# Altium schematic sheet ARM2toARM3_FPA.SchDoc: ARM2 to ARM3 Adapter
size A3; DocumentNumber: 1; SheetNumber: 1; SheetTotal: 1
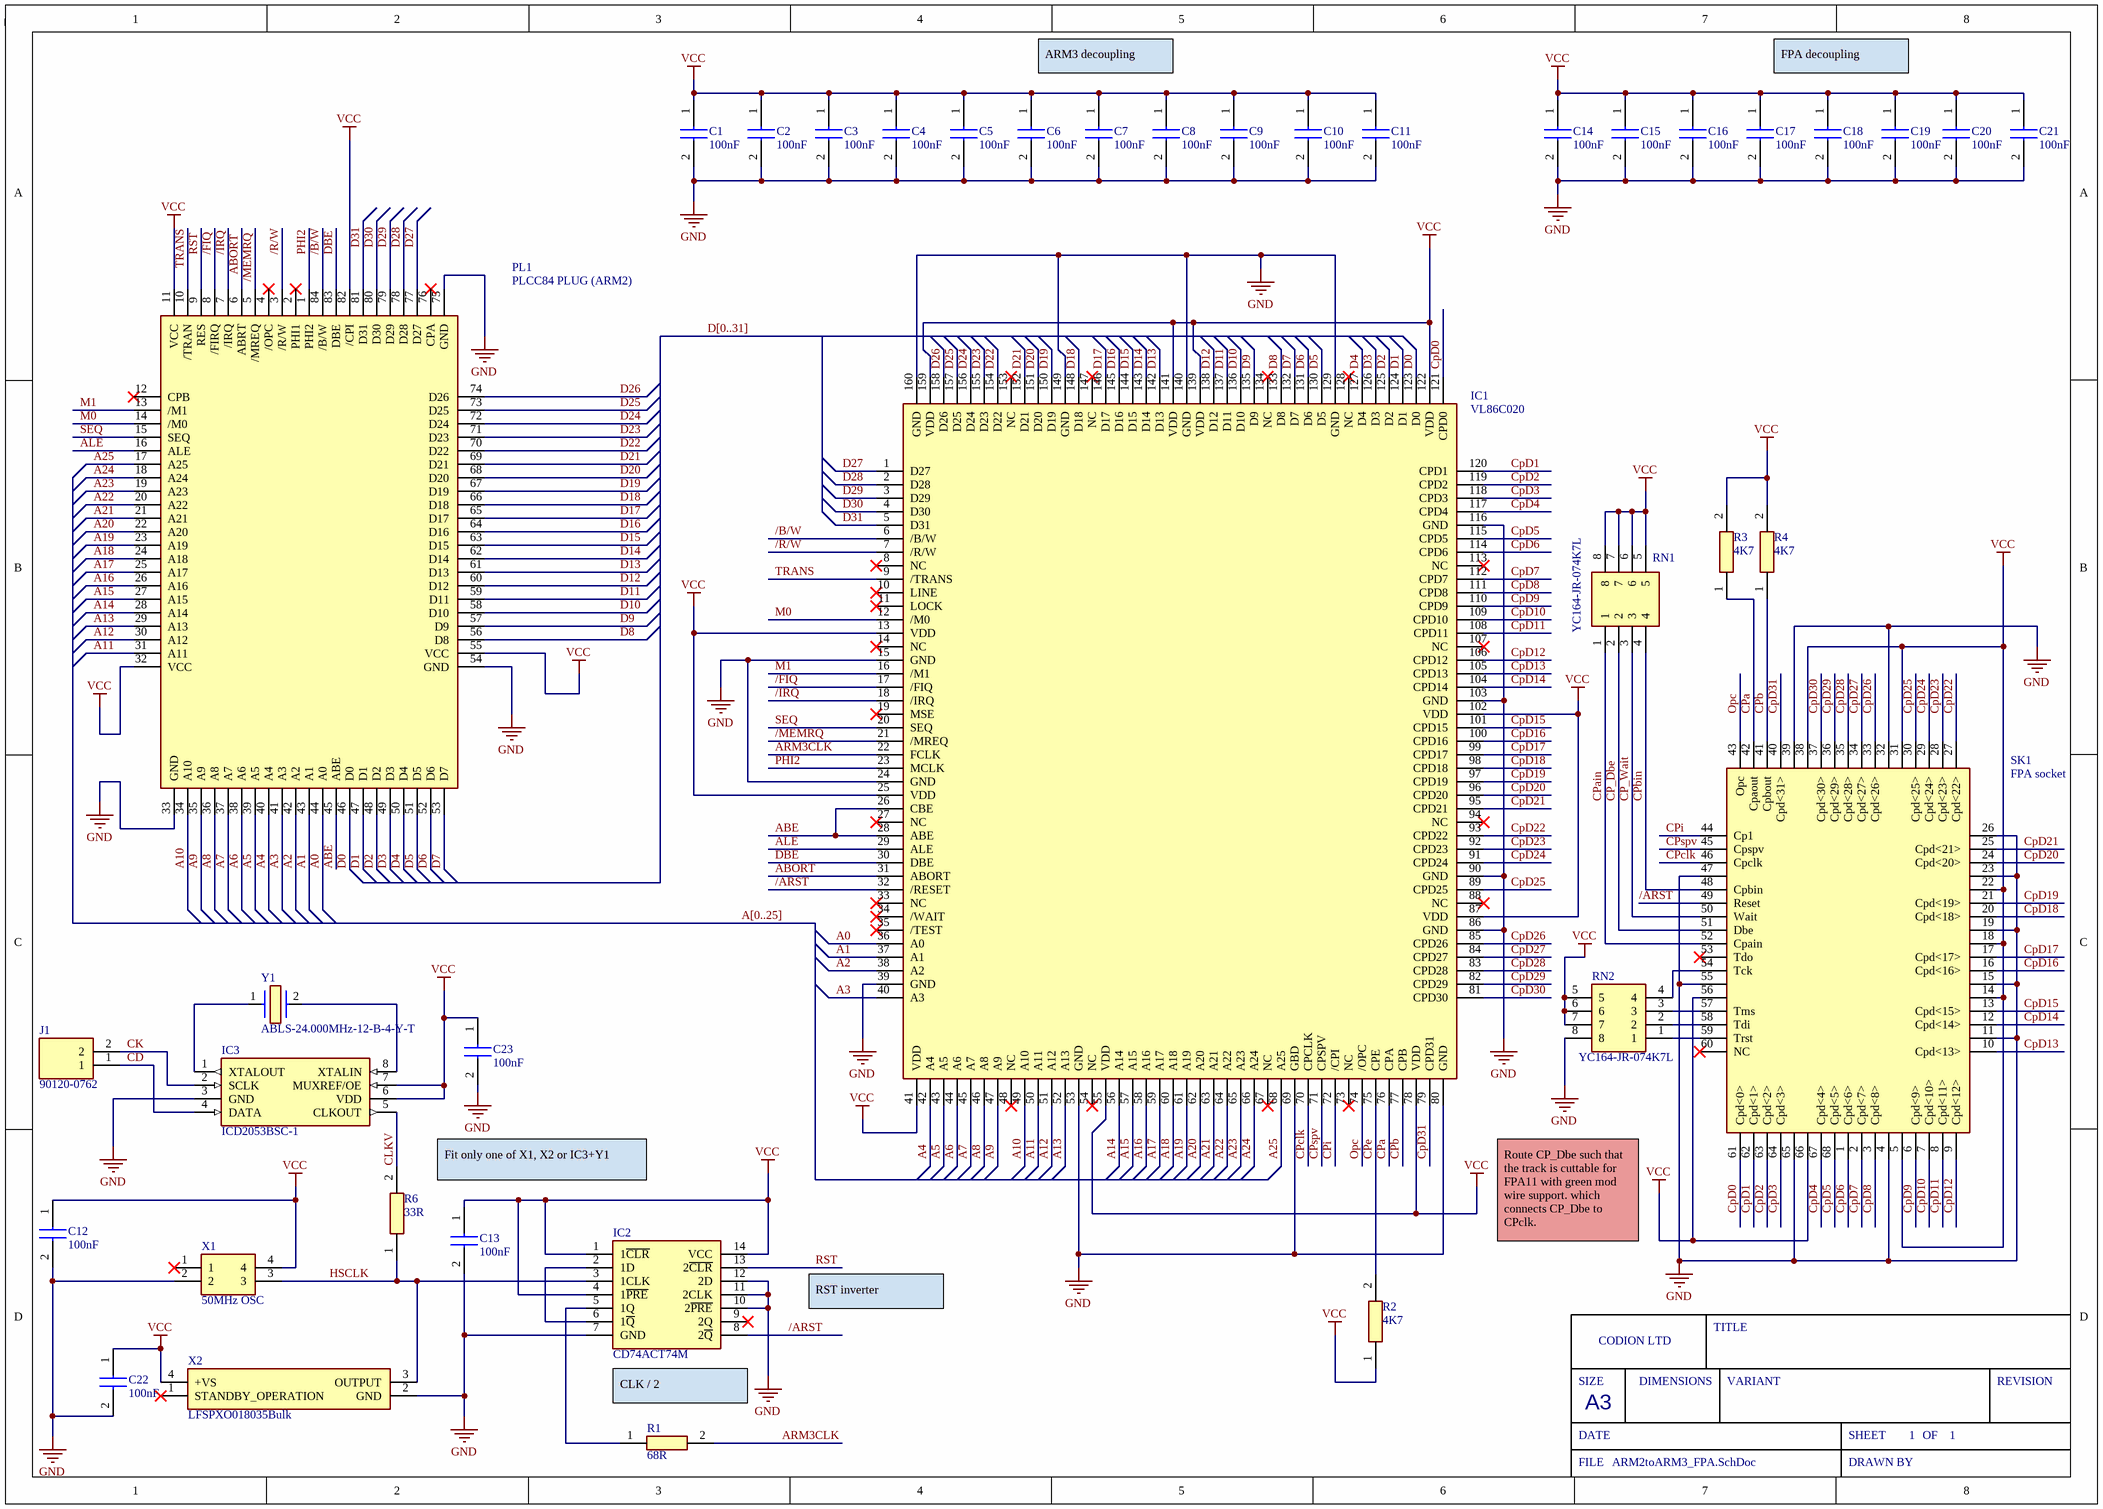
[diagram p0: ARM2toARM3_FPA.SchDoc]

## Parts
C1  100nF  [CAPC2012X145N]
C2  100nF  [CAPC2012X145N]
C3  100nF  [CAPC2012X145N]
C4  100nF  [CAPC2012X145N]
C5  100nF  [CAPC2012X145N]
C6  100nF  [CAPC2012X145N]
C7  100nF  [CAPC2012X145N]
C8  100nF  [CAPC2012X145N]
C9  100nF  [CAPC2012X145N]
C10  100nF  [CAPC2012X145N]
C11  100nF  [CAPC2012X145N]
C12  100nF  [CAPC2012X145N]
C13  100nF  [CAPC2012X145N]
C14  100nF  [CAPC2012X145N]
C15  100nF  [CAPC2012X145N]
C16  100nF  [CAPC2012X145N]
C17  100nF  [CAPC2012X145N]
C18  100nF  [CAPC2012X145N]
C19  100nF  [CAPC2012X145N]
C20  100nF  [CAPC2012X145N]
C21  100nF  [CAPC2012X145N]
C22  100nF  [CAPC2012X145N]
C23  100nF  [CAPC2012X145N]
IC1  VL86C020  [QFP65P3120X3120X407-160N]
IC2  CD74ACT74M  [SOIC127P600X175-14N]
IC3  ICD2053BSC-1  [SOIC127P602X173-8N]
J1  90120-0762  [HDRV2W35P0X254_1X2_508X249X560P]
PL1  PLCC84 PLUG (ARM2)  [PLCC84_PLUG]
R1  value 68R  [RESC2012X50N]  (hidden comment: CRCW080568R0FKEA)
R2  4K7  [RESC1005X40N]
R3  4K7  [RESC1005X40N]
R4  4K7  [RESC1005X40N]
R6  33R  [RESC1005X40N]
RN1  YC164-JR-074K7L  [YC164JR07220RL]
RN2  YC164-JR-074K7L  [YC164JR07220RL]
SK1  FPA socket  [MEMC_Socket]
X1  50MHz OSC  [DIPS762W56P1524L1778H241Q4N]
X2  LFSPXO018035Bulk  [LFSPXO018035Bulk]
Y1  ABLS-24.000MHz-12-B-4-Y-T  [ABLS]

## Nets
GND: C1.2 C2.2 C3.2 C4.2 C5.2 C6.2 C7.2 C8.2 C9.2 C10.2 C11.2 C12.2 C13.2 C14.2 C15.2 C16.2 C17.2 C18.2 C19.2 C20.2 C21.2 C22.2 C23.2 IC1.15(GND) IC1.24(GND) IC1.39(GND) IC1.53(GND) IC1.69(GBD) IC1.80(GND) IC1.86(GND) IC1.90(GND) IC1.103(GND) IC1.116(GND) IC1.129(GND) IC1.140(GND) IC1.149(GND) IC1.160(GND) IC2.7(GND) IC2.10(2~{PRE}) IC2.11(2CLK) IC2.12(2D) IC3.3(GND) PL1.33(GND) PL1.54(GND) PL1.75(GND) RN2.8 SK1.4 SK1.11 SK1.15 SK1.19 SK1.23 SK1.26 SK1.32 SK1.39 SK1.47 SK1.55 SK1.65 X1.2 X2.2(GND)
VCC: C1.1 C2.1 C3.1 C4.1 C5.1 C6.1 C7.1 C8.1 C9.1 C10.1 C11.1 C12.1 C13.1 C14.1 C15.1 C16.1 C17.1 C18.1 C19.1 C20.1 C21.1 C22.1 C23.1 IC1.13(VDD) IC1.25(VDD) IC1.41(VDD) IC1.55(VDD) IC1.78(VDD) IC1.87(VDD) IC1.102(VDD) IC1.122(VDD) IC1.139(VDD) IC1.141(VDD) IC1.159(VDD) IC2.1(1~{CLR}) IC2.4(1~{PRE}) IC2.14(VCC) IC3.6(VDD) IC3.7(MUXREF/OE) PL1.11(VCC) PL1.32(VCC) PL1.55(VCC) PL1.82(/CPI) R2.1 R3.2 R4.2 RN1.5 RN1.6 RN1.7 RN1.8 RN2.5 RN2.6 RN2.7 SK1.5 SK1.14 SK1.18 SK1.22 SK1.31 SK1.38 SK1.56 SK1.66 X1.4 X2.4(+VS)
/ARST: IC1.32(/RESET) IC2.8(2~{Q}) SK1.49(Reset)
/B/W: IC1.6(/B/W) PL1.84(/B/W)
/FIQ: IC1.17(/FIQ) PL1.8(/FIRQ)
/IRQ: IC1.18(/IRQ) PL1.7(/IRQ)
/MEMRQ: IC1.21(/MREQ) PL1.5(/MREQ)
/R/W: IC1.7(/R/W) PL1.3(/R/W)
A0: IC1.36(A0) PL1.44(A0)
A1: IC1.37(A1) PL1.43(A1)
A2: IC1.38(A2) PL1.42(A2)
A3: IC1.40(A3) PL1.41(A3)
A4: IC1.42(A4) PL1.40(A4)
A5: IC1.43(A5) PL1.39(A5)
A6: IC1.44(A6) PL1.38(A6)
A7: IC1.45(A7) PL1.37(A7)
A8: IC1.46(A8) PL1.36(A8)
A9: IC1.47(A9) PL1.35(A9)
A10: IC1.49(A10) PL1.34(A10)
A11: IC1.50(A11) PL1.31(A11)
A12: IC1.51(A12) PL1.30(A12)
A13: IC1.52(A13) PL1.29(A13)
A14: IC1.56(A14) PL1.28(A14)
A15: IC1.57(A15) PL1.27(A15)
A16: IC1.58(A16) PL1.26(A16)
A17: IC1.59(A17) PL1.25(A17)
A18: IC1.60(A18) PL1.24(A18)
A19: IC1.61(A19) PL1.23(A19)
A20: IC1.62(A20) PL1.22(A20)
A21: IC1.63(A21) PL1.21(A21)
A22: IC1.64(A22) PL1.20(A22)
A23: IC1.65(A23) PL1.19(A23)
A24: IC1.66(A24) PL1.18(A24)
A25: IC1.68(A25) PL1.17(A25)
ABE: IC1.26(CBE) IC1.28(ABE) PL1.45(ABE)
ABORT: IC1.31(ABORT) PL1.6(ABRT)
ALE: IC1.29(ALE) PL1.16(ALE)
ARM3CLK: IC1.22(FCLK) R1.2
CD: IC3.4(DATA) J1.1
CK: IC3.2(SCLK) J1.2
CLKV: IC3.5(CLKOUT) R6.2
CP_Dbe: RN1.2 SK1.51(Dbe)
CP_Wait: RN1.3 SK1.50(Wait)
CPa: IC1.76(CPA) R3.1 SK1.42(Cpaout)
CPain: RN1.1 SK1.52(Cpain)
CPb: IC1.77(CPB) R4.1 SK1.41(Cpbout)
CPbin: RN1.4 SK1.48(Cpbin)
CPclk: IC1.70(CPCLK) SK1.46(Cpclk)
CpD0: IC1.121(CPD0) SK1.61(Cpd<0>)
CpD1: IC1.120(CPD1) SK1.62(Cpd<1>)
CpD2: IC1.119(CPD2) SK1.63(Cpd<2>)
CpD3: IC1.118(CPD3) SK1.64(Cpd<3>)
CpD4: IC1.117(CPD4) SK1.67(Cpd<4>)
CpD5: IC1.115(CPD5) SK1.68(Cpd<5>)
CpD6: IC1.114(CPD6) SK1.1(Cpd<6>)
CpD7: IC1.112(CPD7) SK1.2(Cpd<7>)
CpD8: IC1.111(CPD8) SK1.3(Cpd<8>)
CpD9: IC1.110(CPD9) SK1.6(Cpd<9>)
CpD10: IC1.109(CPD10) SK1.7(Cpd<10>)
CpD11: IC1.108(CPD11) SK1.8(Cpd<11>)
CpD12: IC1.106(CPD12) SK1.9(Cpd<12>)
CpD13: IC1.105(CPD13) SK1.10(Cpd<13>)
CpD14: IC1.104(CPD14) SK1.12(Cpd<14>)
CpD15: IC1.101(CPD15) SK1.13(Cpd<15>)
CpD16: IC1.100(CPD16) SK1.16(Cpd<16>)
CpD17: IC1.99(CPD17) SK1.17(Cpd<17>)
CpD18: IC1.98(CPD18) SK1.20(Cpd<18>)
CpD19: IC1.97(CPD19) SK1.21(Cpd<19>)
CpD20: IC1.96(CPD20) SK1.24(Cpd<20>)
CpD21: IC1.95(CPD21) SK1.25(Cpd<21>)
CpD22: IC1.93(CPD22) SK1.27(Cpd<22>)
CpD23: IC1.92(CPD23) SK1.28(Cpd<23>)
CpD24: IC1.91(CPD24) SK1.29(Cpd<24>)
CpD25: IC1.89(CPD25) SK1.30(Cpd<25>)
CpD26: IC1.85(CPD26) SK1.33(Cpd<26>)
CpD27: IC1.84(CPD27) SK1.34(Cpd<27>)
CpD28: IC1.83(CPD28) SK1.35(Cpd<28>)
CpD29: IC1.82(CPD29) SK1.36(Cpd<29>)
CpD30: IC1.81(CPD30) SK1.37(Cpd<30>)
CpD31: IC1.79(CPD31) SK1.40(Cpd<31>)
CPe: IC1.75(CPE) R2.2
CPi: IC1.72(/CPI) SK1.44(Cp1)
CPspv: IC1.71(CPSPV) SK1.45(Cpspv)
D0: IC1.123(D0) PL1.46(D0)
D1: IC1.124(D1) PL1.47(D1)
D2: IC1.125(D2) PL1.48(D2)
D3: IC1.126(D3) PL1.49(D3)
D4: IC1.127(D4) PL1.50(D4)
D5: IC1.130(D5) PL1.51(D5)
D6: IC1.131(D6) PL1.52(D6)
D7: IC1.132(D7) PL1.53(D7)
D8: IC1.133(D8) PL1.56(D8)
D9: IC1.135(D9) PL1.57(D9)
D10: IC1.136(D10) PL1.58(D10)
D11: IC1.137(D11) PL1.59(D11)
D12: IC1.138(D12) PL1.60(D12)
D13: IC1.142(D13) PL1.61(D13)
D14: IC1.143(D14) PL1.62(D14)
D15: IC1.144(D15) PL1.63(D15)
D16: IC1.145(D16) PL1.64(D16)
D17: IC1.146(D17) PL1.65(D17)
D18: IC1.148(D18) PL1.66(D18)
D19: IC1.150(D19) PL1.67(D19)
D20: IC1.151(D20) PL1.68(D20)
D21: IC1.152(D21) PL1.69(D21)
D22: IC1.154(D22) PL1.70(D22)
D23: IC1.155(D23) PL1.71(D23)
D24: IC1.156(D24) PL1.72(D24)
D25: IC1.157(D25) PL1.73(D25)
D26: IC1.158(D26) PL1.74(D26)
D27: IC1.1(D27) PL1.77(D27)
D28: IC1.2(D28) PL1.78(D28)
D29: IC1.3(D29) PL1.79(D29)
D30: IC1.4(D30) PL1.80(D30)
D31: IC1.5(D31) PL1.81(D31)
DBE: IC1.30(DBE) PL1.83(DBE)
HSCLK: IC2.3(1CLK) R6.1 X1.3 X2.3(OUTPUT)
M0: IC1.12(/M0) PL1.14(/M0)
M1: IC1.16(/M1) PL1.13(/M1)
Opc: IC1.74(/OPC) SK1.43(Opc)
PHI2: IC1.23(MCLK) PL1.1(PHI2)
RST: IC2.13(2~{CLR}) PL1.9(RES)
SEQ: IC1.20(SEQ) PL1.15(SEQ)
TRANS: IC1.9(/TRANS) PL1.10(/TRAN)
NetIC2_2: IC2.2(1D) IC2.6(1~{Q})
NetIC2_5: IC2.5(1Q) R1.1
NetIC3_1: IC3.1(XTALOUT) Y1.1
NetIC3_8: IC3.8(XTALIN) Y1.2
NetRN2_1: RN2.1 SK1.59(Trst)
NetRN2_2: RN2.2 SK1.58(Tdi)
NetRN2_3: RN2.3 SK1.57(Tms)
NetRN2_4: RN2.4 SK1.54(Tck)

Not connected (* = marked no-connect by the designer): IC1 8(NC)* 10(LINE)* 11(LOCK)* 14(NC)* 19(MSE)* 27(NC)* 33(NC)* 34(/WAIT)* 35(/TEST)* 48(NC)* 54(NC)* 67(NC)* 73(NC)* 88(NC)* 94(NC)* 107(NC)* 113(NC)* 128(NC)* 134(NC)* 147(NC)* 153(NC)*; IC2 9(2Q)*; PL1 2(PHI1)* 4(/OPC)* 12(CPB)* 76(CPA)*; SK1 53(Tdo)* 60(NC)*; X1 1*; X2 1(STANDBY_OPERATION)*

## Buses and harness runs
bus A[0..25]
bus D[0..31]

## Notes on the sheet
- ARM3 decoupling
- FPA decoupling
- Fit only one of X1, X2 or IC3+Y1
- Route CP_Dbe such that the track is cuttable for FPA11 with green mod wire support. which connects CP_Dbe to CPclk.
- RST inverter
- CLK / 2
- SIZE
- CODION LTD
- DIMENSIONS
- TITLE
- VARIANT
- REVISION
- DATE
- A3
- SHEET
- OF
- FILE
- DRAWN BY

## Library data of the parts
C1-C23 = C2012X7R1H104K125AM: Capacitor; Manufacturer_Name: TDK; Datasheet Link: https://product.tdk.com/info/en/catalog/datasheets/mlcc_commercial_midvoltage_en.pdf; Height: 1.45mm; Manufacturer_Part_Number: C2012X7R1H104K125AM; Mouser Part Number: 810-C2012X7R1H104KT5; Mouser Price/Stock: https://www.mouser.com/Search/Refine.aspx?Keyword=810-C2012X7R1H104KT5; Arrow Part Number: C2012X7R1H104K125AM; Arrow Price/Stock: https://www.arrow.com/en/products/c2012x7r1h104k125am/tdk
IC1 = SAA7146AH_V4,557: ARM3; Manufacturer_Name: VLSI; Manufacturer_Part_Number: VL86C)20; Height: 4.07mm
IC2 = CD74ACT74M: Integrated Circuit; Manufacturer_Name: Texas Instruments; Datasheet Link: http://www.ti.com/lit/ds/symlink/cd74act74.pdf; Height: 1.75mm; Manufacturer_Part_Number: CD74ACT74M; Mouser Part Number: 595-CD74ACT74M; Mouser Price/Stock: https://www.mouser.com/Search/Refine.aspx?Keyword=595-CD74ACT74M
IC3 = ICD2053BSC-1: Integrated Circuit; Manufacturer_Name: Cypress Semiconductor; Datasheet Link: https://www.datasheetarchive.com/pdf/download.php?id=dd30b21a5d816c93cddfaa73a395283274a84c&type=M&term=ICD2053; Height: 1.727mm; Manufacturer_Part_Number: ICD2053BSC-1
J1 = 90120-0762: Connector; Manufacturer_Name: Molex; Datasheet Link: http://www.molex.com/pdm_docs/sd/901200762_sd.pdf; Height: 5.6mm; Manufacturer_Part_Number: 90120-0762; Mouser Part Number: 538-90120-0762; Mouser Price/Stock: https://www.mouser.co.uk/ProductDetail/Molex/90120-0762?qs=NKHyz0HolODkarWFh2VFww%3D%3D; Arrow Part Number: 90120-0762; Arrow Price/Stock: https://www.arrow.com/en/products/90120-0762/molex?region=nac
PL1 = PLCC84_PLUG_ARM2: PLCC84 Plug; Manufacturer_Name: Winslow; Manufacturer_Part_Number: W9328; Height: 15mm
R1 = CRCW080568R0FKEA: 68R Resistor; Manufacturer_Name: Vishay; Datasheet Link: http://www.vishay.com/docs/20035/dcrcwe3.pdf; Height: 0.5mm; Manufacturer_Part_Number: CRCW080568R0FKEA; Mouser Part Number: 71-CRCW080568R0FKEA; Mouser Price/Stock: https://www.mouser.com/Search/Refine.aspx?Keyword=71-CRCW080568R0FKEA; Arrow Part Number: CRCW080568R0FKEA; Arrow Price/Stock: https://www.arrow.com/en/products/crcw080568r0fkea/vishay
R2-R4 = CRCW04024K70FKEDHP: Resistor; Manufacturer_Name: Vishay; Datasheet Link: http://www.vishay.com/docs/20035/dcrcwe3.pdf; Height: 0.4mm; Manufacturer_Part_Number: CRCW04024K70FKEDHP; Mouser Part Number: 71-CRCW04024K70FKEDH; Mouser Price/Stock: https://www.mouser.co.uk/ProductDetail/Vishay-Dale/CRCW04024K70FKEDHP?qs=k2%2FDWSARqgH3ASlI4vM3KQ%3D%3D; Arrow Part Number: CRCW04024K70FKEDHP; Arrow Price/Stock: https://www.arrow.com/en/products/crcw04024k70fkedhp/vishay?region=nac
R6 = CRCW040233R0FKED: Resistor; Manufacturer_Name: Vishay; Datasheet Link: http://www.vishay.com/docs/20035/dcrcwe3.pdf; Height: 0.4mm; Manufacturer_Part_Number: CRCW040233R0FKED; Mouser Part Number: 71-CRCW0402-33-E3; Mouser Price/Stock: https://www.mouser.co.uk/ProductDetail/Vishay-Dale/CRCW040233R0FKED?qs=TNtMkGKFKOyo77UGFlXIJw%3D%3D; Arrow Part Number: CRCW040233R0FKED; Arrow Price/Stock: https://www.arrow.com/en/products/crcw040233r0fked/vishay; LCSC Part #: C137880
RN1 RN2 = YC164-JR-074K7L: Resistor Network; Manufacturer_Name: KEMET; Datasheet Link: https://media.digikey.com/pdf/Data%20Sheets/Yageo%20PDFs/YC102-358,TC122-164_Series_DS.pdf; Height: 0mm; Manufacturer_Part_Number: YC164-JR-074K7L; Mouser Part Number: 603-YC164-JR-074K7L; Mouser Price/Stock: https://www.mouser.co.uk/ProductDetail/YAGEO/YC164-JR-074K7L?qs=R3r%2F0p8sX68YCHdOvgl0Gg%3D%3D; Arrow Part Number: YC164-JR-074K7L; Arrow Price/Stock: https://www.arrow.com/en/products/yc164-jr-074k7l/yageo?region=nac
SK1 = FPA_SKT: Manufacturer_Name: 3M; Manufacturer_Part_Number: 8468-21B1-RK-TR; Datasheet Link: https://www.arrow.com/en/products/8468-21b1-rk-tr/3m; Height: 4.6mm; Mouser Part Number: 517-8468-21B1-RK-TR; Mouser Price/Stock: https://www.mouser.co.uk/ProductDetail/3M-Electronic-Solutions-Division/8468-21B1-RK-TR?qs=X%2F%2F06fXhnJ18zOj3KK47CQ%3D%3D; Arrow Part Number: 8468-21B1-RK-TR; Arrow Price/Stock: https://www.arrow.com/en/products/8468-21b1-rk-tr/3m
X1 = 1107741: Manufacturer_Name: ARIES; Datasheet Link: http://docs-emea.rs-online.com/webdocs/13f3/0900766b813f3237.pdf; Height: 2.41mm; Manufacturer_Part_Number: 1107741; Mouser Part Number: 535-1107741; Mouser Price/Stock: https://www.mouser.co.uk/ProductDetail/Aries-Electronics/1107741?qs=WZRMhwwaLl%2FApwqojhfzdA%3D%3D
X2 = LFSPXO018035Bulk: Crystal or Oscillator; Manufacturer_Name: IQD; Datasheet Link: https://www.iqdfrequencyproducts.com/products/pn/LFSPXO018035Bulk.pdf; Height: 1.4mm; Manufacturer_Part_Number: LFSPXO018035Bulk; Mouser Part Number: 449-LFSPXO018035BULK; Mouser Price/Stock: https://www.mouser.com/Search/Refine.aspx?Keyword=449-LFSPXO018035BULK
Y1 = ABLS-24.000MHz-12-B-4-Y-T: Crystal or Oscillator; Manufacturer_Name: ABRACON; Datasheet Link: https://abracon.com/Resonators/abls.pdf; Manufacturer_Part_Number: ABLS-24.000MHz-12-B-4-Y-T